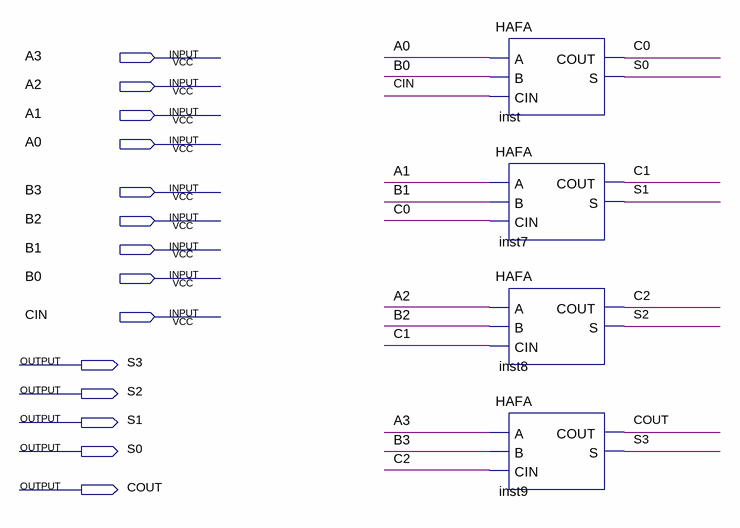
[diagram p0: schematic sheet]
// Quartus schematic ADD4.bdf as structural Verilog: 4 symbols, 14 pins
module ADD4 (
  input  A3,
  input  A2,
  input  A1,
  input  A0,
  input  B3,
  input  B2,
  input  B1,
  input  B0,
  input  CIN,
  output S3,
  output S2,
  output S1,
  output S0,
  output COUT
);

  wire C0, C1, C2;

  HAFA inst (.A(A0), .B(B0), .CIN(CIN), .COUT(C0), .S(S0));
  HAFA inst7 (.A(A1), .B(B1), .CIN(C0), .COUT(C1), .S(S1));
  HAFA inst8 (.A(A2), .B(B2), .CIN(C1), .COUT(C2), .S(S2));
  HAFA inst9 (.A(A3), .B(B3), .CIN(C2), .COUT(COUT), .S(S3));
endmodule
